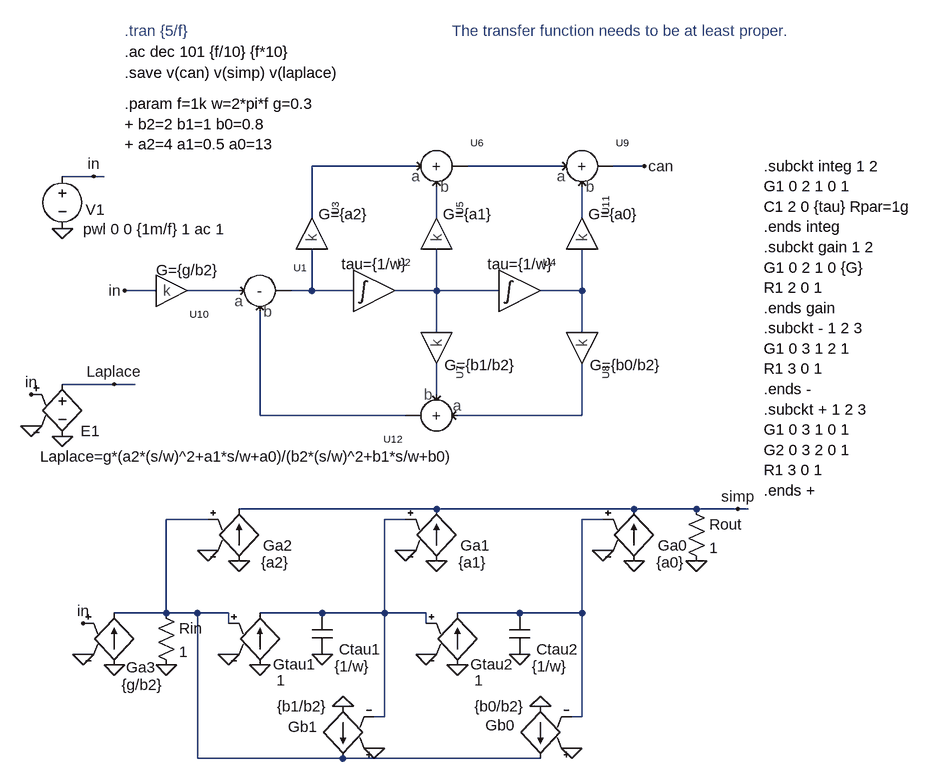
[diagram p0: schematic canonical.asc]
canonical.asc, the LTspice schematic file:
Version 4
SHEET 1 1448 880
WIRE 48 -48 -112 -48
WIRE 272 -48 128 -48
WIRE 400 -48 352 -48
WIRE -448 -32 -496 -32
WIRE -432 -32 -448 -32
WIRE -112 32 -112 -48
WIRE 80 32 80 -16
WIRE 304 32 304 -16
WIRE -352 144 -400 144
WIRE -224 144 -304 144
WIRE -112 144 -112 80
WIRE -112 144 -144 144
WIRE -48 144 -112 144
WIRE 80 144 80 80
WIRE 80 144 16 144
WIRE 176 144 80 144
WIRE 304 144 304 80
WIRE 304 144 240 144
WIRE 80 208 80 144
WIRE 304 208 304 144
WIRE -416 288 -496 288
WIRE -384 288 -416 288
WIRE 80 304 80 256
WIRE -192 336 -192 176
WIRE 32 336 -192 336
WIRE 304 336 304 256
WIRE 304 336 112 336
WIRE 80 480 -224 480
WIRE 384 480 80 480
WIRE 480 480 384 480
WIRE 544 480 480 480
WIRE 560 480 544 480
WIRE -272 496 -336 496
WIRE 32 496 0 496
WIRE 336 496 304 496
WIRE -336 640 -336 496
WIRE -336 640 -416 640
WIRE -288 640 -336 640
WIRE -240 640 -288 640
WIRE -96 640 -192 640
WIRE 0 640 0 496
WIRE 0 640 -96 640
WIRE 64 640 0 640
WIRE 208 640 112 640
WIRE 304 640 304 496
WIRE 304 640 208 640
WIRE -240 656 -240 640
WIRE 64 656 64 640
WIRE 0 800 0 640
WIRE 0 800 -16 800
WIRE 304 800 304 640
WIRE 304 800 288 800
WIRE -288 864 -288 640
WIRE -64 864 -288 864
WIRE 240 864 -64 864
FLAG 400 -48 can
FLAG -496 48 0
FLAG -544 352 0
FLAG -496 368 0
FLAG -448 -32 in
FLAG -400 144 in
FLAG -544 304 in
FLAG -416 288 Laplace
FLAG -96 704 0
FLAG -240 704 0
FLAG -192 720 0
FLAG 112 720 0
FLAG 64 704 0
FLAG 208 704 0
FLAG -272 544 0
FLAG -224 560 0
FLAG 32 544 0
FLAG 80 560 0
FLAG 336 544 0
FLAG 384 560 0
FLAG 480 560 0
FLAG -416 720 0
FLAG -336 720 0
FLAG -464 704 0
FLAG -464 656 in
FLAG -64 784 0
FLAG -16 848 0
FLAG 240 784 0
FLAG 288 848 0
FLAG 544 480 simp
SYMBOL Integ -16 144 R0
SYMATTR SpiceLine tau={1/w}
SYMATTR InstName U2
SYMBOL Integ 208 144 R0
SYMATTR SpiceLine tau={1/w}
SYMATTR InstName U4
SYMBOL Gain 80 224 R90
WINDOW 39 34 -12 VLeft 2
SYMATTR SpiceLine G={b1/b2}
SYMATTR InstName U7
SYMBOL e -496 272 R0
WINDOW 0 28 88 Left 2
WINDOW 3 -34 127 Left 2
SYMATTR InstName E1
SYMATTR Value Laplace=g*(a2*(s/w)^2+a1*s/w+a0)/(b2*(s/w)^2+b1*s/w+b0)
SYMBOL voltage -496 -48 R0
WINDOW 0 36 67 Left 2
WINDOW 3 32 97 Left 2
SYMATTR InstName V1
SYMATTR Value pwl 0 0 {1m/f} 1 ac 1
SYMBOL Gain -336 144 M180
SYMATTR InstName U10
SYMATTR SpiceLine G={g/b2}
SYMBOL Gain 304 224 R90
WINDOW 39 34 -12 VLeft 2
SYMATTR SpiceLine G={b0/b2}
SYMATTR InstName U8
SYMBOL Gain -112 64 M270
WINDOW 39 38 -10 VLeft 2
SYMATTR SpiceLine G={a2}
SYMATTR InstName U3
SYMBOL Gain 80 64 M270
WINDOW 39 38 -10 VLeft 2
SYMATTR SpiceLine G={a1}
SYMATTR InstName U5
SYMBOL Gain 304 64 M270
WINDOW 39 38 -10 VLeft 2
SYMATTR SpiceLine G={a0}
SYMATTR InstName U11
SYMBOL g -192 624 R0
WINDOW 0 20 95 Left 2
WINDOW 3 26 120 Left 2
SYMATTR InstName Gtau1
SYMATTR Value 1
SYMBOL cap -112 640 R0
WINDOW 0 42 56 Left 2
WINDOW 3 35 82 Left 2
SYMATTR InstName Ctau1
SYMATTR Value {1/w}
SYMATTR SpiceLine Rpar=1g
SYMBOL g -224 464 R0
WINDOW 0 37 72 Left 2
WINDOW 3 34 98 Left 2
SYMATTR InstName Ga2
SYMATTR Value {a2}
SYMBOL g -64 880 R180
WINDOW 0 39 65 Left 2
SYMATTR InstName Gb1
SYMATTR Value {b1/b2}
SYMBOL g 240 880 R180
WINDOW 0 39 67 Left 2
SYMATTR InstName Gb0
SYMATTR Value {b0/b2}
SYMBOL res -352 624 R0
SYMATTR InstName Rin
SYMATTR Value 1
SYMBOL res 464 464 R0
SYMATTR InstName Rout
SYMATTR Value 1
SYMBOL cap 192 640 R0
WINDOW 0 42 56 Left 2
WINDOW 3 35 82 Left 2
SYMATTR InstName Ctau2
SYMATTR Value {1/w}
SYMATTR SpiceLine Rpar=1g
SYMBOL g 112 624 R0
WINDOW 0 20 95 Left 2
WINDOW 3 26 120 Left 2
SYMATTR InstName Gtau2
SYMATTR Value 1
SYMBOL g 80 464 R0
WINDOW 0 37 72 Left 2
WINDOW 3 34 98 Left 2
SYMATTR InstName Ga1
SYMATTR Value {a1}
SYMBOL g 384 464 R0
WINDOW 0 37 72 Left 2
WINDOW 3 34 98 Left 2
SYMATTR InstName Ga0
SYMATTR Value {a0}
SYMBOL g -416 624 R0
WINDOW 0 18 100 Left 2
WINDOW 3 11 127 Left 2
SYMATTR InstName Ga3
SYMATTR Value {g/b2}
SYMBOL Math2r -192 144 R0
SYMATTR InstName U1
SYMBOL Math2r 80 -48 R0
SYMATTR Value +
SYMATTR InstName U6
SYMBOL Math2r 304 -48 R0
SYMATTR Value +
SYMATTR InstName U9
SYMBOL Math2r 80 336 R180
SYMATTR Value +
SYMATTR InstName U12
TEXT 584 -48 Left 2 !.subckt integ 1 2\nG1 0 2 1 0 1\nC1 2 0 {tau} Rpar=1g\n.ends integ\n.subckt gain 1 2\nG1 0 2 1 0 {G}\nR1 2 0 1\n.ends gain\n.subckt - 1 2 3\nG1 0 3 1 2 1\nR1 3 0 1\n.ends -\n.subckt + 1 2 3\nG1 0 3 1 0 1\nG2 0 3 2 0 1\nR1 3 0 1\n.ends +
TEXT -400 -144 Left 2 !.param f=1k w=2*pi*f g=0.3\n+ b2=2 b1=1 b0=0.8\n+ a2=4 a1=0.5 a0=13
TEXT -400 -224 Left 2 !.ac dec 101 {f/10} {f*10}
TEXT 104 -256 Left 2 ;The transfer function needs to be at least proper.
TEXT -400 -256 Left 2 ;.tran {5/f}
TEXT -400 -192 Left 2 !.save v(can) v(simp) v(laplace)

The netlist it stands for:
* canonical.asc
XU2 N006 N007 Integ tau={1/w}  ; pins in out
XU4 N007 N008 Integ tau={1/w}  ; pins in out
XU7 N007 N009 Gain G={b1/b2}  ; pins in out
E1 Laplace 0 in 0 Laplace=g*(a2*(s/w)^2+a1*s/w+a0)/(b2*(s/w)^2+b1*s/w+b0)
V1 in 0 pwl 0 0 {1m/f} 1 ac 1
XU10 in N005 Gain G={g/b2}  ; pins in out
XU8 N008 N011 Gain G={b0/b2}  ; pins in out
XU3 N006 N001 Gain G={a2}  ; pins in out
XU5 N007 N003 Gain G={a1}  ; pins in out
XU11 N008 N004 Gain G={a0}  ; pins in out
Gtau1 0 N013 N012 0 1
Ctau1 N013 0 {1/w} Rpar=1g
Ga2 0 simp N012 0 {a2}
Gb1 0 N012 0 N013 {b1/b2}
Gb0 0 N012 0 N014 {b0/b2}
Rin N012 0 1
Rout simp 0 1
Ctau2 N014 0 {1/w} Rpar=1g
Gtau2 0 N014 N013 0 1
Ga1 0 simp N013 0 {a1}
Ga0 0 simp N014 0 {a0}
Ga3 0 N012 in 0 {g/b2}
XU1 N005 N010 N006 -  ; pins a b out
XU6 N001 N003 N002 +  ; pins a b out
XU9 N002 N004 can +  ; pins a b out
XU12 N011 N009 N010 +  ; pins a b out
.subckt integ 1 2
G1 0 2 1 0 1
C1 2 0 {tau} Rpar=1g
.ends integ
.subckt gain 1 2
G1 0 2 1 0 {G}
R1 2 0 1
.ends gain
.subckt - 1 2 3
G1 0 3 1 2 1
R1 3 0 1
.ends -
.subckt + 1 2 3
G1 0 3 1 0 1
G2 0 3 2 0 1
R1 3 0 1
.ends +
.param f=1k w=2*pi*f g=0.3
+ b2=2 b1=1 b0=0.8
+ a2=4 a1=0.5 a0=13
.ac dec 101 {f/10} {f*10}
* The transfer function needs to be at least proper.
* .tran {5/f}
.save v(can) v(simp) v(laplace)
.backanno
.end